# Altium schematic sheet Page 4_Power CPU_DDR.SchDoc: Smart home panel 558.211-7
size A2; Scale: 1:1; Revision: c; SheetNumber: 2; SheetTotal: 3
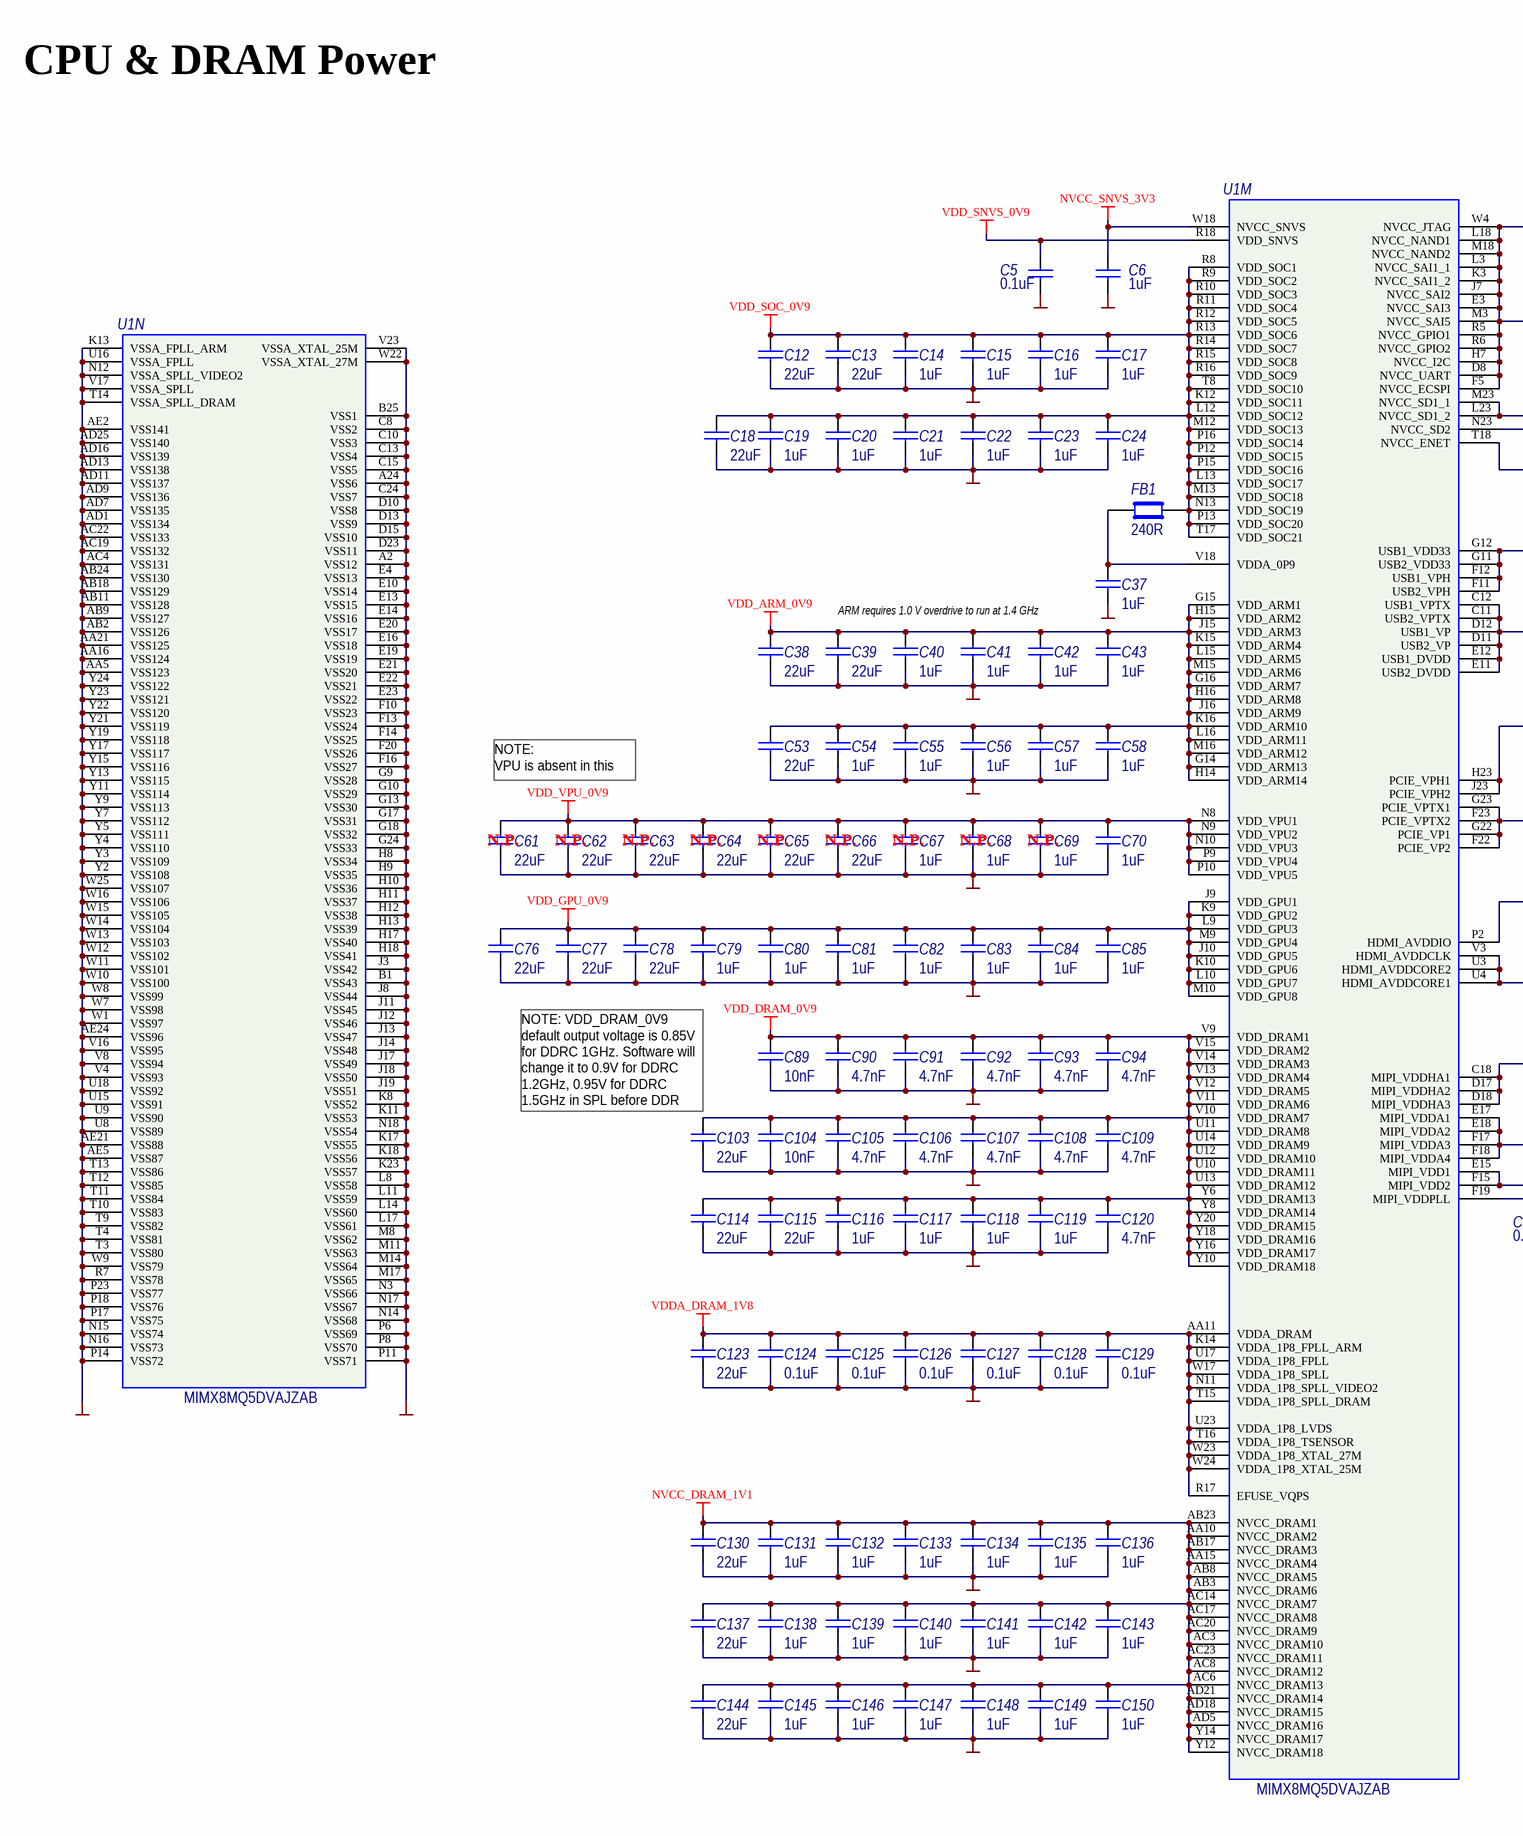
[diagram p0: Page 4_Power CPU_DDR.SchDoc, left]
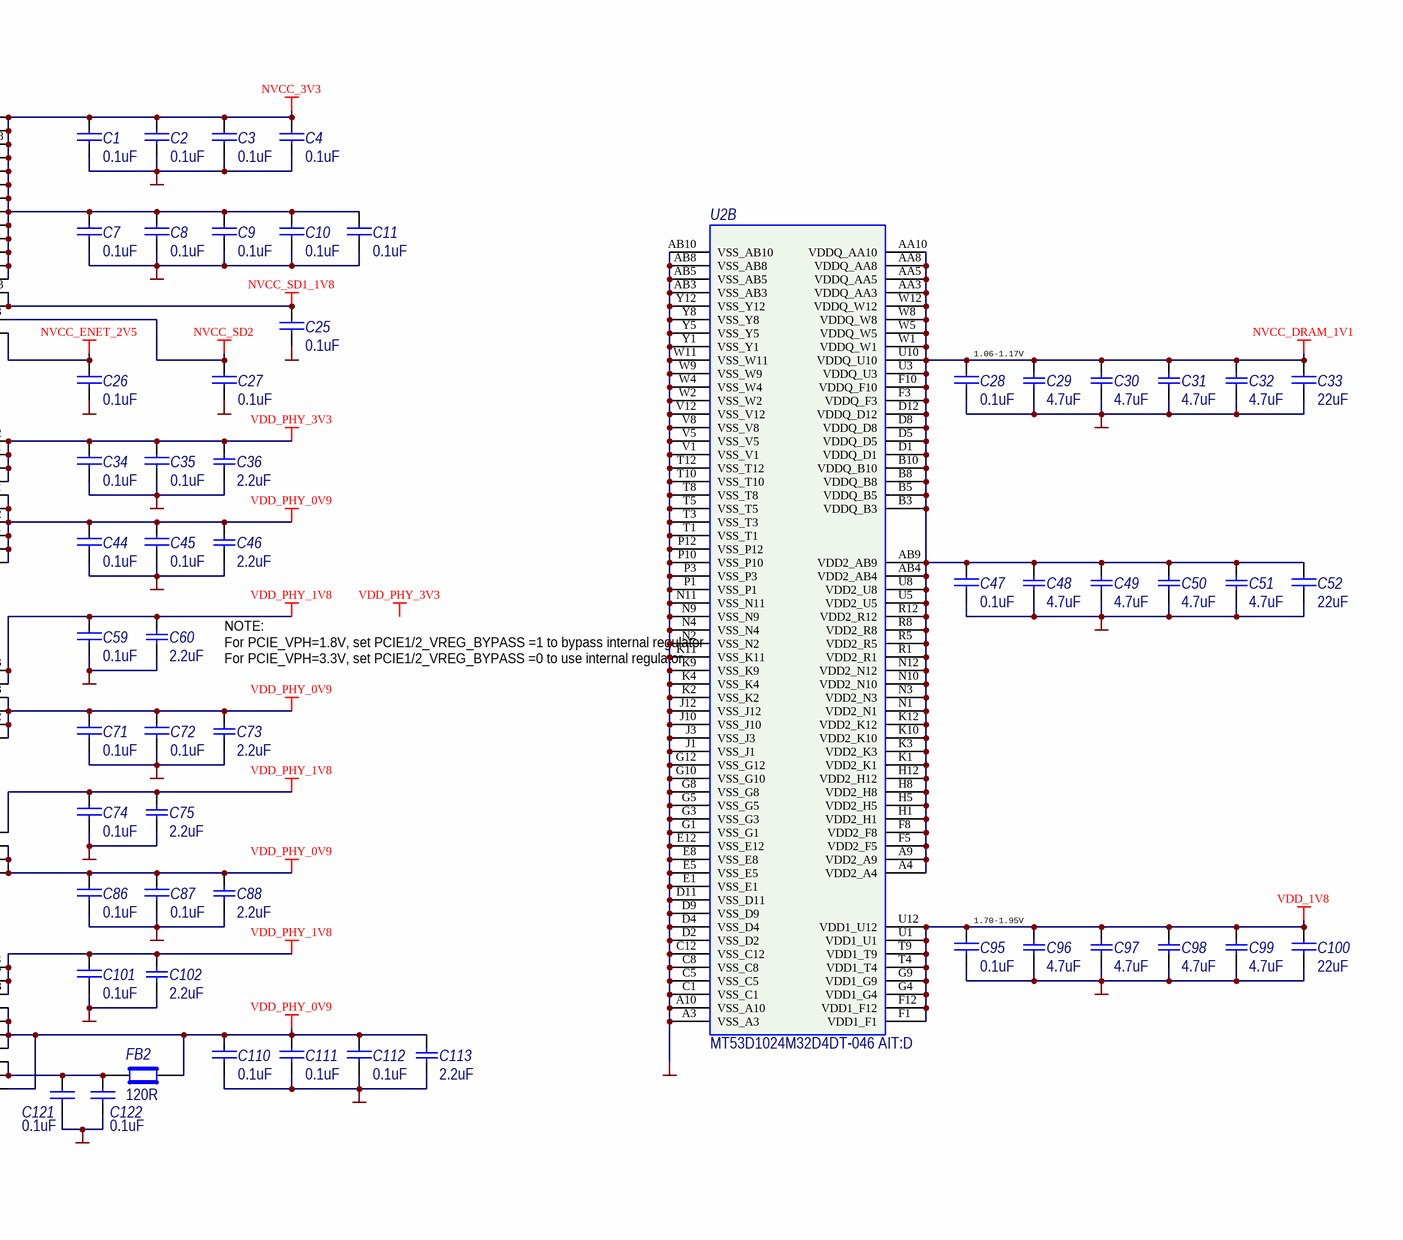
[diagram p1: Page 4_Power CPU_DDR.SchDoc, right]

## Parts
C1  0.1uF  [CC0201_L-R]
C2  0.1uF  [CC0201_L-R]
C3  0.1uF  [CC0201_L-R]
C4  0.1uF  [CC0201_L-R]
C5  0.1uF  [CC0201_L-R]
C6  1uF  [CC0201_L-R]
C7  0.1uF  [CC0201_L-R]
C8  0.1uF  [CC0201_L-R]
C9  0.1uF  [CC0201_L-R]
C10  0.1uF  [CC0201_L-R]
C11  0.1uF  [CC0201_L-R]
C12  22uF  [CC0603_H0.8_L-R]
C13  22uF  [CC0603_H0.8_L-R]
C14  1uF  [CC0201_L-R]
C15  1uF  [CC0201_L-R]
C16  1uF  [CC0201_L-R]
C17  1uF  [CC0201_L-R]
C18  22uF  [CC0603_H0.8_L-R]
C19  1uF  [CC0201_L-R]
C20  1uF  [CC0201_L-R]
C21  1uF  [CC0201_L-R]
C22  1uF  [CC0201_L-R]
C23  1uF  [CC0201_L-R]
C24  1uF  [CC0201_L-R]
C25  0.1uF  [CC0201_L-R]
C26  0.1uF  [CC0201_L-R]
C27  0.1uF  [CC0201_L-R]
C28  0.1uF  [CC0201_L-R]
C29  4.7uF  [CC0402_L-R]
C30  4.7uF  [CC0402_L-R]
C31  4.7uF  [CC0402_L-R]
C32  4.7uF  [CC0402_L-R]
C33  22uF  [CC0603_H0.8_L-R]
C34  0.1uF  [CC0201_L-R]
C35  0.1uF  [CC0201_L-R]
C36  2.2uF  [CC0402_L-R]
C37  1uF  [CC0201_L-R]
C38  22uF  [CC0603_H0.8_L-R]
C39  22uF  [CC0603_H0.8_L-R]
C40  1uF  [CC0201_L-R]
C41  1uF  [CC0201_L-R]
C42  1uF  [CC0201_L-R]
C43  1uF  [CC0201_L-R]
C44  0.1uF  [CC0201_L-R]
C45  0.1uF  [CC0201_L-R]
C46  2.2uF  [CC0402_L-R]
C47  0.1uF  [CC0201_L-R]
C48  4.7uF  [CC0402_L-R]
C49  4.7uF  [CC0402_L-R]
C50  4.7uF  [CC0402_L-R]
C51  4.7uF  [CC0402_L-R]
C52  22uF  [CC0603_H0.8_L-R]
C53  22uF  [CC0603_H0.8_L-R]
C54  1uF  [CC0201_L-R]
C55  1uF  [CC0201_L-R]
C56  1uF  [CC0201_L-R]
C57  1uF  [CC0201_L-R]
C58  1uF  [CC0201_L-R]
C59  0.1uF  [CC0201_L-R]
C60  2.2uF  [CC0402_L-R]
C61  22uF  [CC0603_H0.8_L-R]  (no BOM)
C62  22uF  [CC0603_H0.8_L-R]  (no BOM)
C63  22uF  [CC0603_H0.8_L-R]  (no BOM)
C64  22uF  [CC0603_H0.8_L-R]  (no BOM)
C65  22uF  [CC0603_H0.8_L-R]  (no BOM)
C66  22uF  [CC0603_H0.8_L-R]  (no BOM)
C67  1uF  [CC0201_L-R]  (no BOM)
C68  1uF  [CC0201_L-R]  (no BOM)
C69  1uF  [CC0201_L-R]  (no BOM)
C70  1uF  [CC0201_L-R]
C71  0.1uF  [CC0201_L-R]
C72  0.1uF  [CC0201_L-R]
C73  2.2uF  [CC0402_L-R]
C74  0.1uF  [CC0201_L-R]
C75  2.2uF  [CC0402_L-R]
C76  22uF  [CC0603_H0.8_L-R]
C77  22uF  [CC0603_H0.8_L-R]
C78  22uF  [CC0603_H0.8_L-R]
C79  1uF  [CC0201_L-R]
C80  1uF  [CC0201_L-R]
C81  1uF  [CC0201_L-R]
C82  1uF  [CC0201_L-R]
C83  1uF  [CC0201_L-R]
C84  1uF  [CC0201_L-R]
C85  1uF  [CC0201_L-R]
C86  0.1uF  [CC0201_L-R]
C87  0.1uF  [CC0201_L-R]
C88  2.2uF  [CC0402_L-R]
C89  10nF  [CC0201_L-R]
C90  4.7nF  [CC0201_L-R]
C91  4.7nF  [CC0201_L-R]
C92  4.7nF  [CC0201_L-R]
C93  4.7nF  [CC0201_L-R]
C94  4.7nF  [CC0201_L-R]
C95  0.1uF  [CC0201_L-R]
C96  4.7uF  [CC0402_L-R]
C97  4.7uF  [CC0402_L-R]
C98  4.7uF  [CC0402_L-R]
C99  4.7uF  [CC0402_L-R]
C100  22uF  [CC0603_H0.8_L-R]
C101  0.1uF  [CC0201_L-R]
C102  2.2uF  [CC0402_L-R]
C103  22uF  [CC0603_H0.8_L-R]
C104  10nF  [CC0201_L-R]
C105  4.7nF  [CC0201_L-R]
C106  4.7nF  [CC0201_L-R]
C107  4.7nF  [CC0201_L-R]
C108  4.7nF  [CC0201_L-R]
C109  4.7nF  [CC0201_L-R]
C110  0.1uF  [CC0201_L-R]
C111  0.1uF  [CC0201_L-R]
C112  0.1uF  [CC0201_L-R]
C113  2.2uF  [CC0402_L-R]
C114  22uF  [CC0603_H0.8_L-R]
C115  22uF  [CC0603_H0.8_L-R]
C116  1uF  [CC0201_L-R]
C117  1uF  [CC0201_L-R]
C118  1uF  [CC0201_L-R]
C119  1uF  [CC0201_L-R]
C120  4.7nF  [CC0201_L-R]
C121  0.1uF  [CC0201_L-R]
C122  0.1uF  [CC0201_L-R]
C123  22uF  [CC0603_H0.8_L-R]
C124  0.1uF  [CC0201_L-R]
C125  0.1uF  [CC0201_L-R]
C126  0.1uF  [CC0201_L-R]
C127  0.1uF  [CC0201_L-R]
C128  0.1uF  [CC0201_L-R]
C129  0.1uF  [CC0201_L-R]
C130  22uF  [CC0603_H0.8_L-R]
C131  1uF  [CC0201_L-R]
C132  1uF  [CC0201_L-R]
C133  1uF  [CC0201_L-R]
C134  1uF  [CC0201_L-R]
C135  1uF  [CC0201_L-R]
C136  1uF  [CC0201_L-R]
C137  22uF  [CC0603_H0.8_L-R]
C138  1uF  [CC0201_L-R]
C139  1uF  [CC0201_L-R]
C140  1uF  [CC0201_L-R]
C141  1uF  [CC0201_L-R]
C142  1uF  [CC0201_L-R]
C143  1uF  [CC0201_L-R]
C144  22uF  [CC0603_H0.8_L-R]
C145  1uF  [CC0201_L-R]
C146  1uF  [CC0201_L-R]
C147  1uF  [CC0201_L-R]
C148  1uF  [CC0201_L-R]
C149  1uF  [CC0201_L-R]
C150  1uF  [CC0201_L-R]
FB1  240R  [IND0201_L-R]
FB2  120R  [INDC0603_L-R]
U1  MIMX8MQ5DVAJZAB  [FCPBGA-621_NXP]  (parts M,N of 14)
U2  MT53D1024M32D4DT-046 AIT:D  [VFBGA200_10x14x0.95]  (part B of 2)

## Nets
0V: C1.2 C2.2 C3.2 C4.2 C5.2 C6.2 C7.2 C8.2 C9.2 C10.2 C11.2 C12.2 C13.2 C14.2 C15.2 C16.2 C17.2 C18.2 C19.2 C20.2 C21.2 C22.2 C23.2 C24.2 C25.2 C26.2 C27.2 C28.2 C29.1 C30.1 C31.1 C32.1 C33.2 C34.2 C35.2 C36.1 C37.2 C38.2 C39.2 C40.2 C41.2 C42.2 C43.2 C44.2 C45.2 C46.1 C47.2 C48.1 C49.1 C50.1 C51.1 C52.2 C53.2 C54.2 C55.2 C56.2 C57.2 C58.2 C59.2 C60.1 C61.2 C62.2 C63.2 C64.2 C65.2 C66.2 C67.2 C68.2 C69.2 C70.2 C71.2 C72.2 C73.1 C74.2 C75.1 C76.2 C77.2 C78.2 C79.2 C80.2 C81.2 C82.2 C83.2 C84.2 C85.2 C86.2 C87.2 C88.1 C89.2 C90.2 C91.2 C92.2 C93.2 C94.2 C95.2 C96.1 C97.1 C98.1 C99.1 C100.2 C101.2 C102.1 C103.2 C104.2 C105.2 C106.2 C107.2 C108.2 C109.2 C110.2 C111.2 C112.2 C113.1 C114.2 C115.2 C116.2 C117.2 C118.2 C119.2 C120.2 C121.2 C122.2 C123.2 C124.2 C125.2 C126.2 C127.2 C128.2 C129.2 C130.2 C131.2 C132.2 C133.2 C134.2 C135.2 C136.2 C137.2 C138.2 C139.2 C140.2 C141.2 C142.2 C143.2 C144.2 C145.2 C146.2 C147.2 C148.2 C149.2 C150.2 U1.A2(VSS12) U1.A24(VSS6) U1.AA5(VSS123) U1.AA16(VSS124) U1.AA21(VSS125) U1.AB2(VSS126) U1.AB9(VSS127) U1.AB11(VSS128) U1.AB18(VSS129) U1.AB24(VSS130) U1.AC4(VSS131) U1.AC19(VSS132) U1.AC22(VSS133) U1.AD1(VSS134) U1.AD7(VSS135) U1.AD9(VSS136) U1.AD11(VSS137) U1.AD13(VSS138) U1.AD16(VSS139) U1.AD25(VSS140) U1.AE2(VSS141) U1.AE5(VSS87) U1.AE21(VSS88) U1.AE24(VSS96) U1.B1(VSS43) U1.B25(VSS1) U1.C8(VSS2) U1.C10(VSS3) U1.C13(VSS4) U1.C15(VSS5) U1.C24(VSS7) U1.D10(VSS8) U1.D13(VSS9) U1.D15(VSS10) U1.D23(VSS11) U1.E4(VSS13) U1.E10(VSS14) U1.E13(VSS15) U1.E14(VSS16) U1.E16(VSS18) U1.E19(VSS19) U1.E20(VSS17) U1.E21(VSS20) U1.E22(VSS21) U1.E23(VSS22) U1.F10(VSS23) U1.F13(VSS24) U1.F14(VSS25) U1.F16(VSS27) U1.F20(VSS26) U1.G9(VSS28) U1.G10(VSS29) U1.G13(VSS30) U1.G17(VSS31) U1.G18(VSS32) U1.G24(VSS33) U1.H8(VSS34) U1.H9(VSS35) U1.H10(VSS36) U1.H11(VSS37) U1.H12(VSS38) U1.H13(VSS39) U1.H17(VSS40) U1.H18(VSS41) U1.J3(VSS42) U1.J8(VSS44) U1.J11(VSS45) U1.J12(VSS46) U1.J13(VSS47) U1.J14(VSS48) U1.J17(VSS49) U1.J18(VSS50) U1.J19(VSS51) U1.K8(VSS52) U1.K11(VSS53) U1.K13(VSSA_FPLL_ARM) U1.K17(VSS55) U1.K18(VSS56) U1.K23(VSS57) U1.L8(VSS58) U1.L11(VSS59) U1.L14(VSS60) U1.L17(VSS61) U1.M8(VSS62) U1.M11(VSS63) U1.M14(VSS64) U1.M17(VSS65) U1.N3(VSS66) U1.N12(VSSA_SPLL_VIDEO2) U1.N14(VSS68) U1.N15(VSS74) U1.N16(VSS73) U1.N17(VSS67) U1.N18(VSS54) U1.P6(VSS69) U1.P8(VSS70) U1.P11(VSS71) U1.P14(VSS72) U1.P17(VSS75) U1.P18(VSS76) U1.P23(VSS77) U1.R7(VSS78) U1.T3(VSS80) U1.T4(VSS81) U1.T9(VSS82) U1.T10(VSS83) U1.T11(VSS84) U1.T12(VSS85) U1.T13(VSS86) U1.T14(VSSA_SPLL_DRAM) U1.U8(VSS89) U1.U9(VSS90) U1.U15(VSS91) U1.U16(VSSA_FPLL) U1.U18(VSS92) U1.V4(VSS93) U1.V8(VSS94) U1.V16(VSS95) U1.V17(VSSA_SPLL) U1.V23(VSSA_XTAL_25M) U1.W1(VSS97) U1.W7(VSS98) U1.W8(VSS99) U1.W9(VSS79) U1.W10(VSS100) U1.W11(VSS101) U1.W12(VSS102) U1.W13(VSS103) U1.W14(VSS104) U1.W15(VSS105) U1.W16(VSS106) U1.W22(VSSA_XTAL_27M) U1.W25(VSS107) U1.Y2(VSS108) U1.Y3(VSS109) U1.Y4(VSS110) U1.Y5(VSS111) U1.Y7(VSS112) U1.Y9(VSS113) U1.Y11(VSS114) U1.Y13(VSS115) U1.Y15(VSS116) U1.Y17(VSS117) U1.Y19(VSS118) U1.Y21(VSS119) U1.Y22(VSS120) U1.Y23(VSS121) U1.Y24(VSS122) U2.A3(VSS_A3) U2.A10(VSS_A10) U2.AB3(VSS_AB3) U2.AB5(VSS_AB5) U2.AB8(VSS_AB8) U2.AB10(VSS_AB10) U2.C1(VSS_C1) U2.C5(VSS_C5) U2.C8(VSS_C8) U2.C12(VSS_C12) U2.D2(VSS_D2) U2.D4(VSS_D4) U2.D9(VSS_D9) U2.D11(VSS_D11) U2.E1(VSS_E1) U2.E5(VSS_E5) U2.E8(VSS_E8) U2.E12(VSS_E12) U2.G1(VSS_G1) U2.G3(VSS_G3) U2.G5(VSS_G5) U2.G8(VSS_G8) U2.G10(VSS_G10) U2.G12(VSS_G12) U2.J1(VSS_J1) U2.J3(VSS_J3) U2.J10(VSS_J10) U2.J12(VSS_J12) U2.K2(VSS_K2) U2.K4(VSS_K4) U2.K9(VSS_K9) U2.K11(VSS_K11) U2.N2(VSS_N2) U2.N4(VSS_N4) U2.N9(VSS_N9) U2.N11(VSS_N11) U2.P1(VSS_P1) U2.P3(VSS_P3) U2.P10(VSS_P10) U2.P12(VSS_P12) U2.T1(VSS_T1) U2.T3(VSS_T3) U2.T5(VSS_T5) U2.T8(VSS_T8) U2.T10(VSS_T10) U2.T12(VSS_T12) U2.V1(VSS_V1) U2.V5(VSS_V5) U2.V8(VSS_V8) U2.V12(VSS_V12) U2.W2(VSS_W2) U2.W4(VSS_W4) U2.W9(VSS_W9) U2.W11(VSS_W11) U2.Y1(VSS_Y1) U2.Y5(VSS_Y5) U2.Y8(VSS_Y8) U2.Y12(VSS_Y12)
NVCC_3V3: C1.1 C2.1 C3.1 C4.1 C7.1 C8.1 C9.1 C10.1 C11.1 U1.D8(NVCC_UART) U1.E3(NVCC_SAI3) U1.F5(NVCC_ECSPI) U1.H7(NVCC_I2C) U1.J7(NVCC_SAI2) U1.K3(NVCC_SAI1_2) U1.L3(NVCC_SAI1_1) U1.L18(NVCC_NAND1) U1.M3(NVCC_SAI5) U1.M18(NVCC_NAND2) U1.R5(NVCC_GPIO1) U1.R6(NVCC_GPIO2) U1.W4(NVCC_JTAG)
NVCC_DRAM_1V1: C28.1 C29.2 C30.2 C31.2 C32.2 C33.1 C47.1 C48.2 C49.2 C50.2 C51.2 C52.1 C130.1 C131.1 C132.1 C133.1 C134.1 C135.1 C136.1 C137.1 C138.1 C139.1 C140.1 C141.1 C142.1 C143.1 C144.1 C145.1 C146.1 C147.1 C148.1 C149.1 C150.1 U1.AA10(NVCC_DRAM2) U1.AA15(NVCC_DRAM4) U1.AB3(NVCC_DRAM6) U1.AB8(NVCC_DRAM5) U1.AB17(NVCC_DRAM3) U1.AB23(NVCC_DRAM1) U1.AC3(NVCC_DRAM10) U1.AC6(NVCC_DRAM13) U1.AC8(NVCC_DRAM12) U1.AC14(NVCC_DRAM7) U1.AC17(NVCC_DRAM8) U1.AC20(NVCC_DRAM9) U1.AC23(NVCC_DRAM11) U1.AD5(NVCC_DRAM16) U1.AD18(NVCC_DRAM15) U1.AD21(NVCC_DRAM14) U1.Y12(NVCC_DRAM18) U1.Y14(NVCC_DRAM17) U2.A4(VDD2_A4) U2.A9(VDD2_A9) U2.AA3(VDDQ_AA3) U2.AA5(VDDQ_AA5) U2.AA8(VDDQ_AA8) U2.AA10(VDDQ_AA10) U2.AB4(VDD2_AB4) U2.AB9(VDD2_AB9) U2.B3(VDDQ_B3) U2.B5(VDDQ_B5) U2.B8(VDDQ_B8) U2.B10(VDDQ_B10) U2.D1(VDDQ_D1) U2.D5(VDDQ_D5) U2.D8(VDDQ_D8) U2.D12(VDDQ_D12) U2.F3(VDDQ_F3) U2.F5(VDD2_F5) U2.F8(VDD2_F8) U2.F10(VDDQ_F10) U2.H1(VDD2_H1) U2.H5(VDD2_H5) U2.H8(VDD2_H8) U2.H12(VDD2_H12) U2.K1(VDD2_K1) U2.K3(VDD2_K3) U2.K10(VDD2_K10) U2.K12(VDD2_K12) U2.N1(VDD2_N1) U2.N3(VDD2_N3) U2.N10(VDD2_N10) U2.N12(VDD2_N12) U2.R1(VDD2_R1) U2.R5(VDD2_R5) U2.R8(VDD2_R8) U2.R12(VDD2_R12) U2.U3(VDDQ_U3) U2.U5(VDD2_U5) U2.U8(VDD2_U8) U2.U10(VDDQ_U10) U2.W1(VDDQ_W1) U2.W5(VDDQ_W5) U2.W8(VDDQ_W8) U2.W12(VDDQ_W12)
NVCC_ENET_2V5: C26.1 U1.T18(NVCC_ENET)
NVCC_SD1_1V8: C25.1 U1.L23(NVCC_SD1_2) U1.M23(NVCC_SD1_1)
NVCC_SD2: C27.1 U1.N23(NVCC_SD2)
NVCC_SNVS_3V3: C6.1 U1.W18(NVCC_SNVS)
VDD_1V8: C95.1 C96.2 C97.2 C98.2 C99.2 C100.1 U2.F1(VDD1_F1) U2.F12(VDD1_F12) U2.G4(VDD1_G4) U2.G9(VDD1_G9) U2.T4(VDD1_T4) U2.T9(VDD1_T9) U2.U1(VDD1_U1) U2.U12(VDD1_U12)
VDD_ARM_0V9: C38.1 C39.1 C40.1 C41.1 C42.1 C43.1 C53.1 C54.1 C55.1 C56.1 C57.1 C58.1 U1.G14(VDD_ARM13) U1.G15(VDD_ARM1) U1.G16(VDD_ARM7) U1.H14(VDD_ARM14) U1.H15(VDD_ARM2) U1.H16(VDD_ARM8) U1.J15(VDD_ARM3) U1.J16(VDD_ARM9) U1.K15(VDD_ARM4) U1.K16(VDD_ARM10) U1.L15(VDD_ARM5) U1.L16(VDD_ARM11) U1.M15(VDD_ARM6) U1.M16(VDD_ARM12)
VDD_DRAM_0V9: C89.1 C90.1 C91.1 C92.1 C93.1 C94.1 C103.1 C104.1 C105.1 C106.1 C107.1 C108.1 C109.1 C114.1 C115.1 C116.1 C117.1 C118.1 C119.1 C120.1 U1.U10(VDD_DRAM11) U1.U11(VDD_DRAM8) U1.U12(VDD_DRAM10) U1.U13(VDD_DRAM12) U1.U14(VDD_DRAM9) U1.V9(VDD_DRAM1) U1.V10(VDD_DRAM7) U1.V11(VDD_DRAM6) U1.V12(VDD_DRAM5) U1.V13(VDD_DRAM4) U1.V14(VDD_DRAM3) U1.V15(VDD_DRAM2) U1.Y6(VDD_DRAM13) U1.Y8(VDD_DRAM14) U1.Y10(VDD_DRAM18) U1.Y16(VDD_DRAM17) U1.Y18(VDD_DRAM16) U1.Y20(VDD_DRAM15)
VDD_GPU_0V9: C76.1 C77.1 C78.1 C79.1 C80.1 C81.1 C82.1 C83.1 C84.1 C85.1 U1.J9(VDD_GPU1) U1.J10(VDD_GPU5) U1.K9(VDD_GPU2) U1.K10(VDD_GPU6) U1.L9(VDD_GPU3) U1.L10(VDD_GPU7) U1.M9(VDD_GPU4) U1.M10(VDD_GPU8)
VDD_PHY_0V9: C44.1 C45.1 C46.2 C71.1 C72.1 C73.2 C86.1 C87.1 C88.2 C110.1 C111.1 C112.1 C113.2 FB2.2 U1.C11(USB2_VPTX) U1.C12(USB1_VPTX) U1.D11(USB2_VP) U1.D12(USB1_VP) U1.E11(USB2_DVDD) U1.E12(USB1_DVDD) U1.E17(MIPI_VDDA1) U1.E18(MIPI_VDDA2) U1.F17(MIPI_VDDA3) U1.F18(MIPI_VDDA4) U1.F19(MIPI_VDDPLL) U1.F22(PCIE_VP2) U1.F23(PCIE_VPTX2) U1.G22(PCIE_VP1) U1.G23(PCIE_VPTX1) U1.U3(HDMI_AVDDCORE2) U1.U4(HDMI_AVDDCORE1) U1.V3(HDMI_AVDDCLK)
VDD_PHY_1V8: C59.1 C60.2 C74.1 C75.2 C101.1 C102.2 U1.C18(MIPI_VDDHA1) U1.D17(MIPI_VDDHA2) U1.D18(MIPI_VDDHA3) U1.H23(PCIE_VPH1) U1.J23(PCIE_VPH2) U1.P2(HDMI_AVDDIO)
VDD_PHY_3V3: C34.1 C35.1 C36.2 U1.F11(USB2_VPH) U1.F12(USB1_VPH) U1.G11(USB2_VDD33) U1.G12(USB1_VDD33)
VDD_SNVS_0V9: C5.1 U1.R18(VDD_SNVS)
VDD_SOC_0V9: C12.1 C13.1 C14.1 C15.1 C16.1 C17.1 C18.1 C19.1 C20.1 C21.1 C22.1 C23.1 C24.1 FB1.2 U1.K12(VDD_SOC11) U1.L12(VDD_SOC12) U1.L13(VDD_SOC17) U1.M12(VDD_SOC13) U1.M13(VDD_SOC18) U1.N13(VDD_SOC19) U1.P12(VDD_SOC15) U1.P13(VDD_SOC20) U1.P15(VDD_SOC16) U1.P16(VDD_SOC14) U1.R8(VDD_SOC1) U1.R9(VDD_SOC2) U1.R10(VDD_SOC3) U1.R11(VDD_SOC4) U1.R12(VDD_SOC5) U1.R13(VDD_SOC6) U1.R14(VDD_SOC7) U1.R15(VDD_SOC8) U1.R16(VDD_SOC9) U1.T8(VDD_SOC10) U1.T17(VDD_SOC21)
VDD_VPU_0V9: C61.1 C62.1 C63.1 C64.1 C65.1 C66.1 C67.1 C68.1 C69.1 C70.1 U1.N8(VDD_VPU1) U1.N9(VDD_VPU2) U1.N10(VDD_VPU3) U1.P9(VDD_VPU4) U1.P10(VDD_VPU5)
VDDA_DRAM_1V8: C123.1 C124.1 C125.1 C126.1 C127.1 C128.1 C129.1 U1.AA11(VDDA_DRAM) U1.K14(VDDA_1P8_FPLL_ARM) U1.N11(VDDA_1P8_SPLL_VIDEO2) U1.R17(EFUSE_VQPS) U1.T15(VDDA_1P8_SPLL_DRAM) U1.T16(VDDA_1P8_TSENSOR) U1.U17(VDDA_1P8_FPLL) U1.U23(VDDA_1P8_LVDS) U1.W17(VDDA_1P8_SPLL) U1.W23(VDDA_1P8_XTAL_27M) U1.W24(VDDA_1P8_XTAL_25M)
NetC37_1: C37.1 FB1.1 U1.V18(VDDA_0P9)
NetC121_1: C121.1 C122.1 FB2.1 U1.E15(MIPI_VDD1) U1.F15(MIPI_VDD2)

## Notes on the sheet
- CPU & DRAM Power
- 1.06-1.17V
- ARM requires 1.0 V overdrive to run at 1.4 GHz
- NOTE:
  VPU is absent in this CPU
- (near U2) NOTE:
  For PCIE_VPH=1.8V, set PCIE1/2_VREG_BYPASS =1 to bypass internal regulator
  For PCIE_VPH=3.3V, set PCIE1/2_VREG_BYPASS =0 to use internal regulator
- (near C61) N.P.
- (near C62) N.P.
- (near C63) N.P.
- (near C64) N.P.
- (near C65) N.P.
- (near C66) N.P.
- (near C67) N.P.
- (near C68) N.P.
- (near C69) N.P.
- 1.70-1.95V
- (near C103) NOTE: VDD_DRAM_0V9 default output voltage is 0.85V for DDRC 1GHz. Software will change it to 0.9V for DDRC 1.2GHz, 0.95V for DDRC 1.5GHz in SPL before DDR initialization.
- Labels drawn without touching a wire or pin: VDD_PHY_3V3
- Title
- Size:
- Date:
- A3
- Revision:
- Sheet
- of
- Drawn By:
- Checked By:
- File:

## Library data of the parts
C1-C5 C7-C11 C25-C28 C34 C35 C44 C45 C47 C59 C71 C72 C74 C86 C87 C95 C101 C110-C112 C121 C122 C124-C129 = GRM033Z71C104KE14D: CAP CER 0.1 uF 16V 10% X7R 0201; Manufacturer: Murata; Supplier 1: Digi-Key; Supplier Part Number 1: 490-GRM033Z71C104KE14DCT-ND; Manufacturer Part Number: GRM033Z71C104KE14D; Category: Ceramic Capacitors; Stock 1: 685706; Pricing 1: 1=0.10000, 10=0.03100, 50=0.01700, 100=0.01390, 500=0.00990, 1000=0.00778, 2500=0.00707, 5000=0.00650 (USD); Case/Package: 0201; RoHS Compliant: Yes
C6 C14-C17 C19-C24 C37 C40-C43 C54-C58 C67-C70 C79-C85 C116-C119 C131-C136 C138-C143 C145-C150 = CC0201KRX5R5BB105: CAP CER 1.0 uF 6.3V 10% X5R 0201; Manufacturer: Yageo; Supplier 1: Digi-Key; Manufacturer Part Number: CC0201KRX5R5BB105; Category: Ceramic Capacitors; Stock 1: 4821405; Pricing 1: 1=0.10000, 10=0.04600, 50=0.02500, 100=0.02050, 500=0.01464, 1000=0.01150, 2500=0.01045, 5000=0.00962 (USD); Mounting Technology: Surface Mount; Case/Package: 0201; Case Code (Imperial): 0201; Case Code (Metric): 0603; Min Operating Temperature: -55°C; Max Operating Temperature: 85°C; Packaging: Cut Tape; Value: 1uF; Tolerance: 10%; RoHS Compliant: Yes; ComponentLink1URL: http://www.yageo.com/documents/recent/UPY-GPHC_X5R_4V-to-50V_25.pdf?src-supplier=Digi-Key; ComponentLink1Description: http://www.yageo.com/documents/recent/UPY-GPHC_X5R_4V-to-50V_25.pdf?src-supplier=Digi-Key; ComponentLink2URL: https://www.yageo.com/upload/media/product/productsearch/datasheet/mlcc/UPY-GPHC_X5R_4V-to-50V_26.pdf?src-supplier=Digi-Key; ComponentLink2Description: https://www.yageo.com/upload/media/product/productsearch/datasheet/mlcc/UPY-GPHC_X5R_4V-to-50V_26.pdf?src-supplier=Digi-Key; Voltage Rating: 6.3V; Supplier Part Number 1: 311-3471-1-ND
C12 C13 C18 C33 C38 C39 C52 C53 C61-C66 C76-C78 C100 C103 C114 C115 C123 C130 C137 C144 = GRM188R61A226ME15J: CAP CER 22 uF 10V 20% X5R 0603; Manufacturer: Murata; ComponentLink1URL: http://www.murata.com/products/catalog/pdf/c02e.pdf; ComponentLink1Description: http://www.murata.com/products/catalog/pdf/c02e.pdf; Supplier 1: Digi-Key; Manufacturer Part Number: GRM188R61A226ME15J; Category: Ceramic Capacitors; Stock 1: 24355; Pricing 1: 1=0.18000, 10=0.12500, 50=0.07500, 100=0.06340, 500=0.04336, 1000=0.03835, 2500=0.03668, 5000=0.03335 (USD); Voltage Rating (DC): 10V; Dielectric: X5R; Tolerance: 20%; Value: 22uF; Length: 1.6mm; Width: 800um; Thickness: 800um; RoHS Compliant: Yes; ComponentLink2URL: http://search.murata.co.jp/Ceramy/image/img/A01X/G101/ENG/GRM188R61A226ME15-01.pdf?src-supplier=Digi-Key; ComponentLink2Description: http://search.murata.co.jp/Ceramy/image/img/A01X/G101/ENG/GRM188R61A226ME15-01.pdf?src-supplier=Digi-Key; Supplier Part Number 1: 490-GRM188R61A226ME15JCT-ND
C29-C32 C48-C51 C96-C99 = GRM155R61A475KEAAD: CAP CER 4.7uF 10V X5R 10% 0402 Murata; RoHS Compliant: Yes; Supplier 1: LCSC; Supplier Part Number 1: C77004; Manufacturer: Murata; Manufacturer Part Number: GRM155R61A475KEAAD; ComponentLink1Description: DS; ComponentLink1URL: https://datasheet.lcsc.com/lcsc/1811081617_Murata-Electronics-GRM155R61A475KEAAD_C77004.pdf; ComponentLink2Description: LCSC; ComponentLink2URL: https://lcsc.com/product-detail/Multilayer-Ceramic-Capacitors-MLCC-SMD-SMT_Murata-Electronics-GRM155R61A475KEAAD_C77004.html; RoHS: Yes; Category: Ceramic Capacitors; Stock 1: 285900; Pricing 1: 50=0,09257, 500=0,06813, 1500=0,06364, 5000=0,05915, 25000=0,05715, 50000=0,05617 (USD)
C36 C46 C60 C73 C75 C88 C102 C113 = GRT155R61C225KE13D: CAP CER 2.2 uF 16V X5R 10% 0402 Murata; Supplier 1: Digi-Key; Supplier Part Number 1: 490-12259-1-ND; Manufacturer: Murata; Manufacturer Part Number: GRT155R61C225KE13D; Category: Ceramic Capacitors; Stock 1: 60026; Pricing 1: 1=0.16000, 10=0.11000, 50=0.06260, 100=0.05190, 500=0.03638, 1000=0.03012, 2500=0.02803, 5000=0.02565 (USD); Mounting Technology: Surface Mount; Case/Package: 0402; Case Code (Metric): 1005; Case Code (Imperial): 0402; Min Operating Temperature: -55°C; Max Operating Temperature: 85°C; Packaging: Tape and Reel; Value: 2.2uF; Voltage Rating: 16V; Tolerance: 10%; Length: 0.039inch; Width: 0.02inch; Thickness: 0.022inch; Ratings: AEC-Q200; RoHS Compliant: Yes; ComponentLink1URL: http://search.murata.co.jp/Ceramy/image/img/A01X/G101/ENG/GRT155R61C225KE13-01.pdf?src-supplier=Digi-Key; ComponentLink1Description: http://search.murata.co.jp/Ceramy/image/img/A01X/G101/ENG/GRT155R61C225KE13-01.pdf?src-supplier=Digi-Key
C89 C104 = GRM033R71C103KE14D: CAP CER 10 nF 16V 10% X7R 0201; Manufacturer: Murata; Supplier 1: Digi-Key; Manufacturer Part Number: GRM033R71C103KE14D; Category: Ceramic Capacitors; Stock 1: 3351995; Pricing 1: 1=0.10000, 10=0.01200, 50=0.00660, 100=0.00540, 500=0.00388, 1000=0.00306, 2500=0.00278, 5000=0.00256 (USD); Voltage Rating (DC): 16V; Dielectric: X7R; Tolerance: 10%; Value: 10nF; Length: 600um; Width: 300um; Thickness: 300um; RoHS Compliant: Yes; ComponentLink1URL: http://www.farnell.com/datasheets/2867848.pdf?src-supplier=Farnell; ComponentLink1Description: http://www.farnell.com/datasheets/2867848.pdf?src-supplier=Farnell; ComponentLink2URL: http://www.farnell.com/datasheets/2722745.pdf?src-supplier=Element14; ComponentLink2Description: http://www.farnell.com/datasheets/2722745.pdf?src-supplier=Element14; ComponentLink3URL: http://search.murata.co.jp/Ceramy/image/img/A01X/G101/ENG/GRM033R71C103KE14-01.pdf?src-supplier=Digi-Key; ComponentLink3Description: http://search.murata.co.jp/Ceramy/image/img/A01X/G101/ENG/GRM033R71C103KE14-01.pdf?src-supplier=Digi-Key; ComponentLink4URL: http://www.farnell.com/datasheets/2867848.pdf?src-supplier=Newark; ComponentLink4Description: http://www.farnell.com/datasheets/2867848.pdf?src-supplier=Newark; Supplier Part Number 1: 490-14453-1-ND
C90-C94 C105-C109 C120 = GRM033R71C472KE14D: CAP CER 4.7 nF 16V 10% X7R 0201; Manufacturer: Murata; Supplier 1: Digi-Key; Supplier Part Number 1: 490-17113-1-ND; Manufacturer Part Number: GRM033R71C472KE14D; Category: Ceramic Capacitors; Stock 1: 112000; Pricing 1: 1=0.10000, 10=0.01000, 50=0.00540, 100=0.00450, 500=0.00318, 1000=0.00250, 2500=0.00227, 5000=0.00209 (USD); Voltage Rating (DC): 16V; Dielectric: X7R; Tolerance: 10%; Value: 4.7nF; Length: 600um; Width: 300um; Thickness: 300um; RoHS Compliant: Yes; ComponentLink1URL: https://search.murata.co.jp/Ceramy/image/img/A01X/G101/ENG/GRM033R71C472KE14-01.pdf?src-supplier=Digi-Key; ComponentLink1Description: https://search.murata.co.jp/Ceramy/image/img/A01X/G101/ENG/GRM033R71C472KE14-01.pdf?src-supplier=Digi-Key
FB1 = BLM03AX241SN1D: FERRITE CHIP 240 OHM 350mA 0201; Manufacturer: Murata; Material: Steel; Tolerance: 25%; Number of Lines: 1; DC Resistance (DCR): 380mR; Test Frequency: 100MHz; Supplier 1: Digi-Key; Supplier Part Number 1: 490-5623-1-ND; Manufacturer Part Number: BLM03AX241SN1D; Category: Ferrite Beads and Chips; Stock 1: 378283; Pricing 1: 1=0.10000, 10=0.02600, 25=0.02320, 50=0.02120, 100=0.01910, 250=0.01400, 500=0.01018, 1000=0.00997, 5000=0.00679 (USD); Case/Package: 0201; Pins: 2; Case Code (Metric): 0603; Case Code (Imperial): 0201; Min Operating Temperature: -55°C; Max Operating Temperature: 125°C; Package Quantity: 1; Impedance: 240R; Packaging: Tape and Reel; Current Rating: 350mA; Max Current Rating: 350mA; Max DC Current: 350mA; Termination: SMD/SMT; Number of Circuits: 1; Series: BLM03AX; Length: 0.024inch; Width: 0.3mm; Height: 0.3mm; RoHS Compliant: Yes; ComponentLink1URL: https://datasheet.ciiva.com/41449/001172129-da-01-en-drossel-0201-240r-30-6x0-3mm-15000st-41449419.pdf?src-supplier=Conrad; ComponentLink1Description: https://datasheet.ciiva.com/41449/001172129-da-01-en-drossel-0201-240r-30-6x0-3mm-15000st-41449419.pdf?src-supplier=Conrad; ComponentLink2URL: https://datasheet.ciiva.com/1012/l0110e-1012684.pdf?src-supplier=Digi-Key; ComponentLink2Description: https://datasheet.ciiva.com/1012/l0110e-1012684.pdf?src-supplier=Digi-Key; ComponentLink3URL: https://datasheet.ciiva.com/1012/l0110e-1012683.pdf?src-supplier=Digi-Key; ComponentLink3Description: https://datasheet.ciiva.com/1012/l0110e-1012683.pdf?src-supplier=Digi-Key; ComponentLink4URL: https://datasheet.ciiva.com/1012/l0110e-1012685.pdf?src-supplier=Digi-Key; ComponentLink4Description: https://datasheet.ciiva.com/1012/l0110e-1012685.pdf?src-supplier=Digi-Key
FB2 = BLM18PG121SH1D: FERRITE CHIP 120 OHM 2A 0603; Manufacturer: Murata; Number of Circuits: 1; Tolerance: 25%; DC Resistance (DCR): 50mR; Test Frequency: 100MHz; Shielding: Unshielded; Supplier 1: Digi-Key; Supplier Part Number 1: 490-7815-1-ND; Manufacturer Part Number: BLM18PG121SH1D; Category: Ferrite Beads and Chips; Stock 1: 361964; Pricing 1: 1=0.11000, 10=0.08600, 25=0.07720, 50=0.05660, 100=0.04890, 250=0.03864, 500=0.03262, 1000=0.02747 (USD); Mounting Technology: Surface Mount; Case/Package: 0603; Case Code (Metric): 1608; Case Code (Imperial): 0603; Weight: 7.1E-05oz; Contact Plating: Tin,Matte; Material: Ferrite; Min Operating Temperature: -55°C; Max Operating Temperature: 125°C; Impedance: 120R; Packaging: Tape and Reel; Package Quantity: 4000; Current Rating: 2A; Max Current Rating: 2A; Number of Lines: 1; Termination: SMD/SMT; Max DC Current: 2A; Series: EMIFIL®, BLM18P; DC Resistance-Max: 50mR; Length: 1.6mm; Width: 0.031inch; Height: 0.8mm; Depth: 0.8mm; Ratings: AEC-Q200; RoHS Compliant: Yes; Lead Free: Lead Free; ComponentLink1URL: https://datasheet.ciiva.com/16419/l0132s0193blm18p-16419183.pdf?src-supplier=Future+Electronics; ComponentLink1Description: https://datasheet.ciiva.com/16419/l0132s0193blm18p-16419183.pdf?src-supplier=Future+Electronics
U1 = I.MX8MQ5DVAJZAB: ARM Cortex-A53 Microprocessor IC i.MX8MQ 4 Core, 64-Bit 1.5GHz 621-FCPBGA (17x17); Manufacturer: NXP Semiconductors; Supplier 1: Digi-Key; Manufacturer Part Number: MIMX8MQ5DVAJZAB; Category: Microprocessors; Stock 1: 760; Pricing 1: 1=71.97000, 10=58.78600, 90=53.09733 (USD); Supplier Part Number 1: 568-14719-ND
U2 = MT53D1024M32D4DT: DRAM Chip LPDDR4 SDRAM 32Gbit 1024M X 32 200-Ball VFBGA; Manufacturer: Micron Technology; Memory Format: Volatile; Memory Size: 32Gb; Frequency: 2.133GHz; Supplier 1: Mouser; Manufacturer Part Number: MT53D1024M32D4DT-046 AIT:D; Category: Memory; Stock 1: 741; Pricing 1: 1=52.55000, 10=48.75000, 50=45.83000, 100=40.20000, 1000=40.20000, 10000=40.20000 (USD); Min Operating Temperature: -40°C; Max Operating Temperature: 95°C; Supplier Part Number 1: 340-343901-TRAY